# EAGLE schematic DL110 (EAGLE 9.6.2)
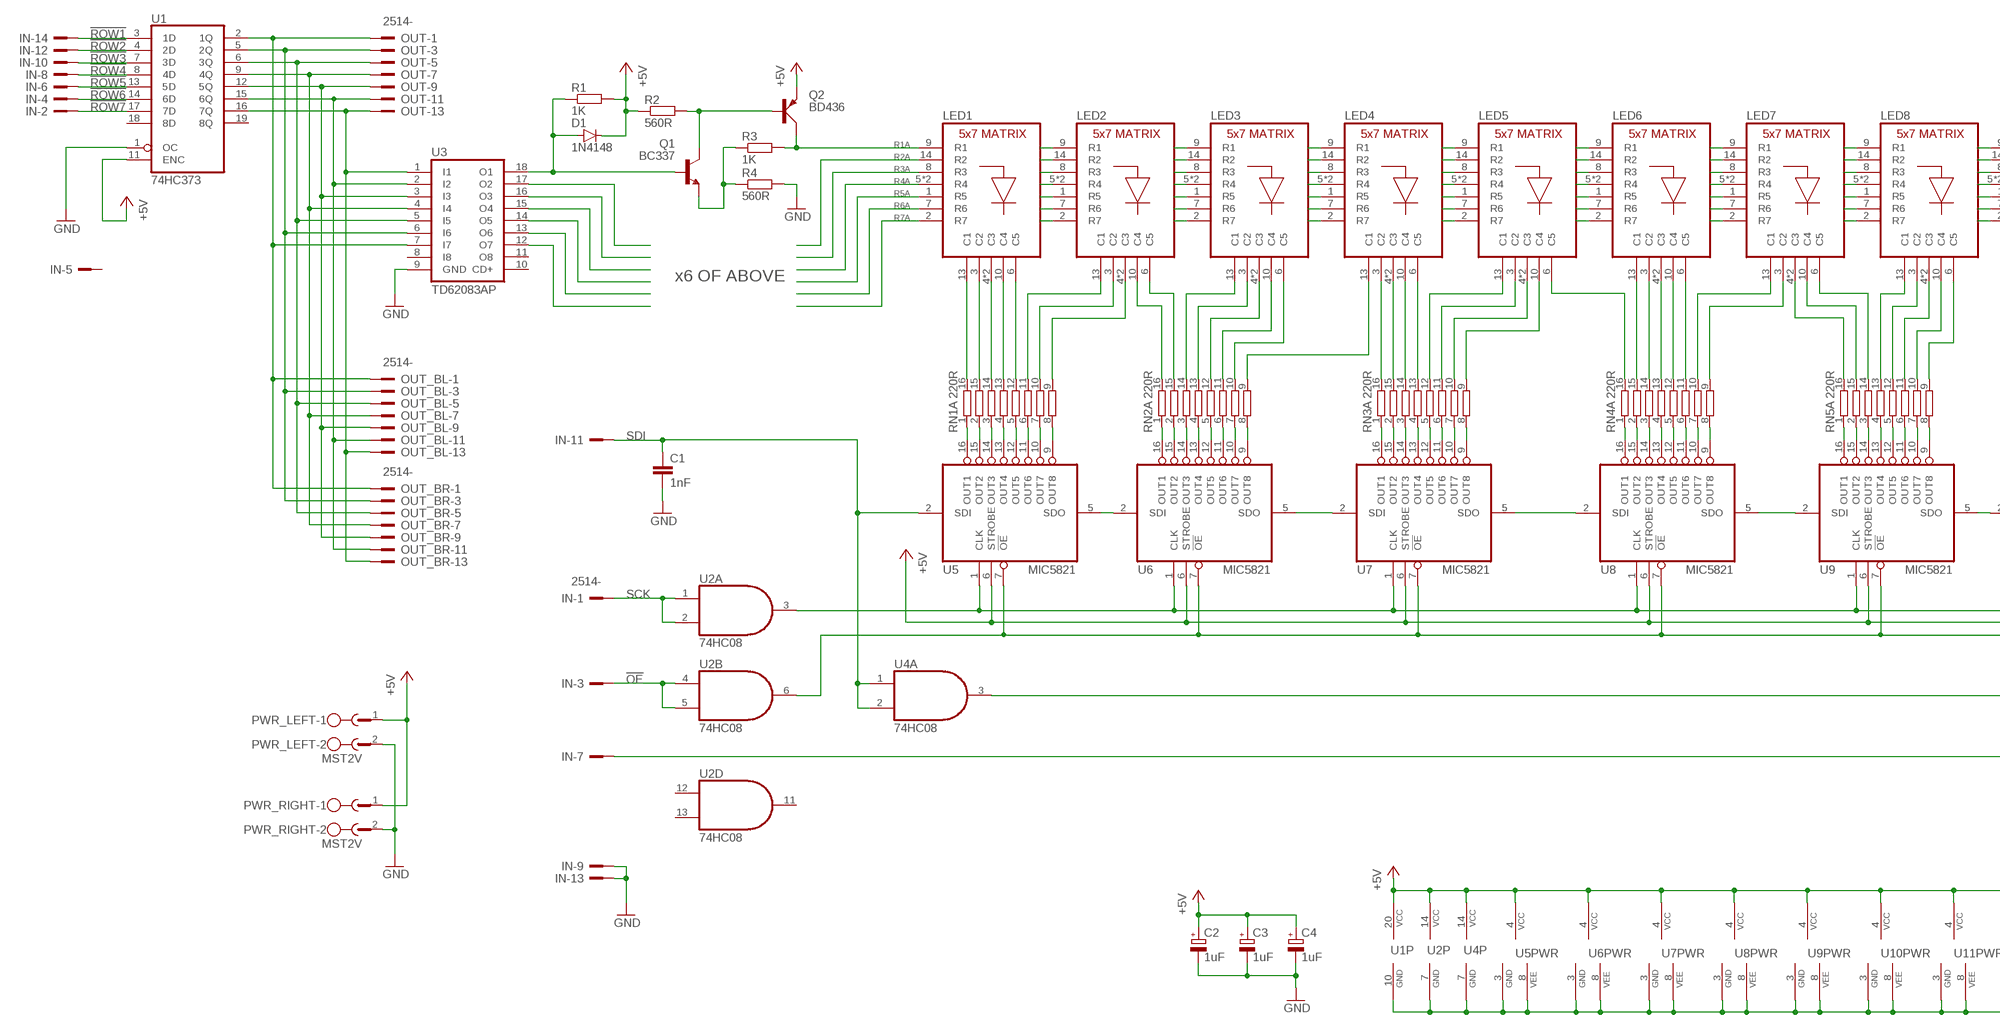
[diagram p0: schematic, sheet 1, part 1 of 2]
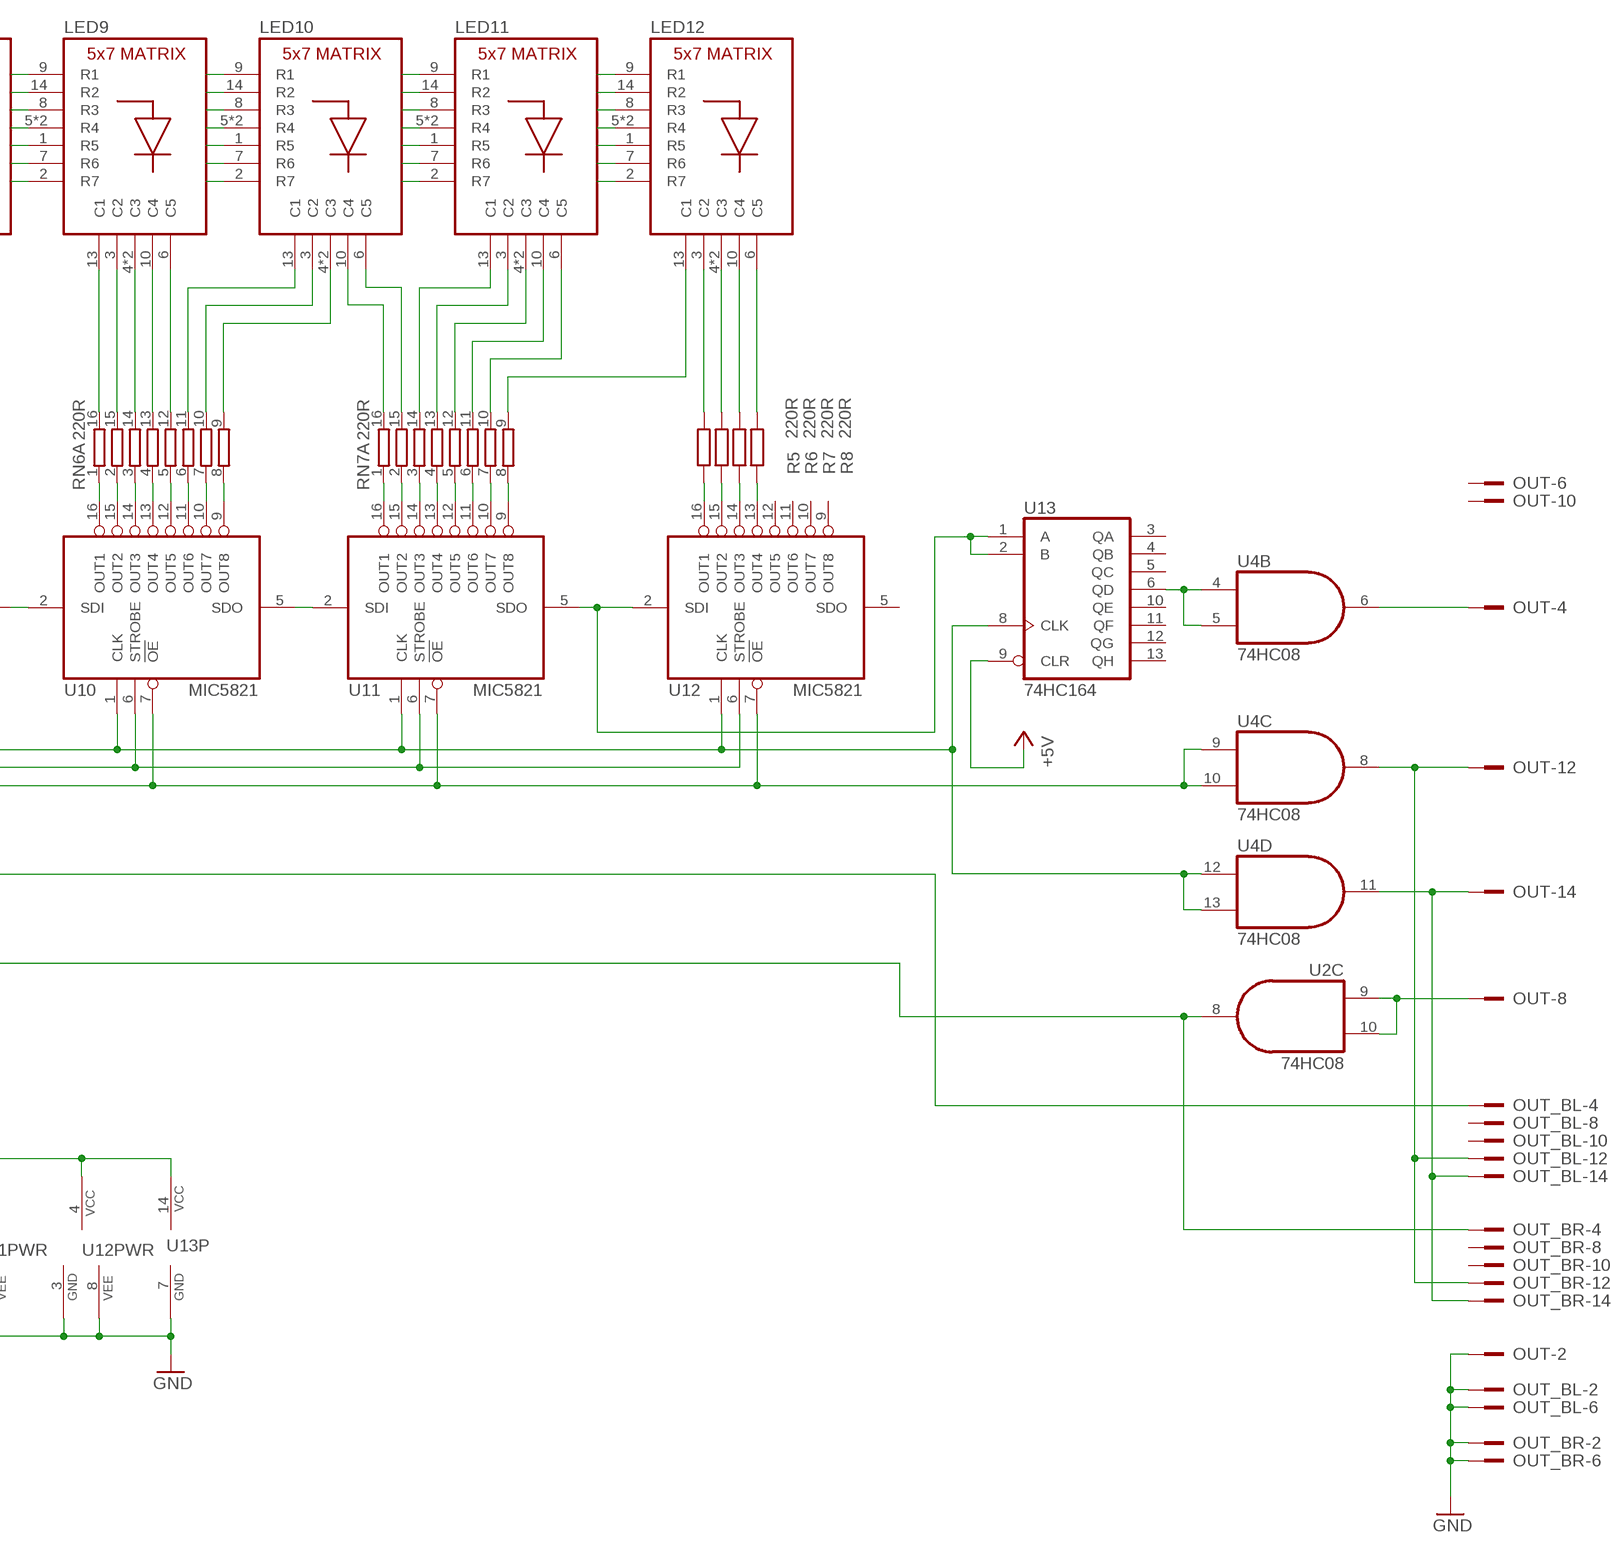
[diagram p1: schematic, sheet 1, part 2 of 2]

## Parts
C1  1nF  C-EU050-025X075  [C050-025X075]
C2  1uF  CPOL-EUE2.5-5  [E2,5-5]
C3  1uF  CPOL-EUE2.5-5  [E2,5-5]
C4  1uF  CPOL-EUE2.5-5  [E2,5-5]
D1  1N4148  1N4148DO35-10  [DO35-10]
IN  2514-  [PAK100/2500-14]
LED1  CSM-57141  [CSM-57141]
LED2  CSM-57141  [CSM-57141]
LED3  CSM-57141  [CSM-57141]
LED4  CSM-57141  [CSM-57141]
LED5  CSM-57141  [CSM-57141]
LED6  CSM-57141  [CSM-57141]
LED7  CSM-57141  [CSM-57141]
LED8  CSM-57141  [CSM-57141]
LED9  CSM-57141  [CSM-57141]
LED10  CSM-57141  [CSM-57141]
LED11  CSM-57141  [CSM-57141]
LED12  CSM-57141  [CSM-57141]
OUT  2514-  [PAK100/2500-14]
OUT_BL  2514-  [PAK100/2500-14]
OUT_BR  2514-  [PAK100/2500-14]
PWR_LEFT  MST2V  [MSTBV2]
PWR_RIGHT  MST2V  [MSTBV2]
Q1  BC337  [TO92]
Q2  BD436  BD438  [TO126AV]
R1  1K  R-EU_0207/10  [0207/10]
R2  560R  R-EU_0207/10  [0207/10]
R3  1K  R-EU_0207/10  [0207/10]
R4  560R  R-EU_0207/10  [0207/10]
R5  220R  R-EU_0207/10  [0207/10]
R6  220R  R-EU_0207/10  [0207/10]
R7  220R  R-EU_0207/10  [0207/10]
R8  220R  R-EU_0207/10  [0207/10]
RN1  220R  8R-N  [DIL16]
RN2  220R  8R-N  [DIL16]
RN3  220R  8R-N  [DIL16]
RN4  220R  8R-N  [DIL16]
RN5  220R  8R-N  [DIL16]
RN6  220R  8R-N  [DIL16]
RN7  220R  8R-N  [DIL16]
U1  74HC373  74LS373N  [DIL20]
U2  74HC08  74LS08N  [DIL14]
U3  TD62083AP  ULN2803A  [DIL18]
U4  74HC08  74LS08N  [DIL14]
U5  MIC5821  MIC5821BN  [DIL16]
U6  MIC5821  MIC5821BN  [DIL16]
U7  MIC5821  MIC5821BN  [DIL16]
U8  MIC5821  MIC5821BN  [DIL16]
U9  MIC5821  MIC5821BN  [DIL16]
U10  MIC5821  MIC5821BN  [DIL16]
U11  MIC5821  MIC5821BN  [DIL16]
U12  MIC5821  MIC5821BN  [DIL16]
U13  74HC164  74LS164N  [DIL14]

## Nets
!OE!: IN.3 U2.4(B:I0) U2.5(B:I1)
!ROW1!: IN.14 U1.3(1D)
!ROW2!: IN.12 U1.4(2D)
!ROW3!: IN.10 U1.7(3D)
!ROW4!: IN.8 U1.8(4D)
!ROW5!: IN.6 U1.13(5D)
!ROW6!: IN.4 U1.14(6D)
!ROW7!: IN.2 U1.17(7D)
+5V: C2.+ C3.+ C4.+ D1.C PWR_LEFT.1 PWR_RIGHT.1 Q2.E R1.2 R2.1 U1.11(ENC) U1.20(VCC) U2.14(P:VCC) U4.14(P:VCC) U5.4(VCC) U5.6(STROBE) U6.4(VCC) U6.6(STROBE) U7.4(VCC) U7.6(STROBE) U8.4(VCC) U8.6(STROBE) U9.4(VCC) U9.6(STROBE) U10.4(VCC) U10.6(STROBE) U11.4(VCC) U11.6(STROBE) U12.4(VCC) U12.6(STROBE) U13.9(CLR) U13.14(VCC)
GND: C1.2 C2.- C3.- C4.- IN.9 IN.13 OUT.2 OUT_BL.2 OUT_BL.6 OUT_BR.2 OUT_BR.6 PWR_LEFT.2 PWR_RIGHT.2 R4.2 U1.1(OC) U1.10(GND) U2.7(P:GND) U3.9(GND) U4.7(P:GND) U5.3(GND) U5.8(VEE) U6.3(GND) U6.8(VEE) U7.3(GND) U7.8(VEE) U8.3(GND) U8.8(VEE) U9.3(GND) U9.8(VEE) U10.3(GND) U10.8(VEE) U11.3(GND) U11.8(VEE) U12.3(GND) U12.8(VEE) U13.7(GND)
N$1: U2.3(A:O) U4.12(D:I0) U4.13(D:I1) U5.1(CLK) U6.1(CLK) U7.1(CLK) U8.1(CLK) U9.1(CLK) U10.1(CLK) U11.1(CLK) U12.1(CLK) U13.8(CLK)
N$2: U2.6(B:O) U4.9(C:I0) U4.10(C:I1) U5.7(!OE!) U6.7(!OE!) U7.7(!OE!) U8.7(!OE!) U9.7(!OE!) U10.7(!OE!) U11.7(!OE!) U12.7(!OE!)
N$3: OUT_BL.4 U4.3(A:O)
N$8: IN.7 OUT_BR.4 U2.8(C:O)
N$11: OUT.1 OUT_BL.1 OUT_BR.1 U1.2(1Q) U3.7(I7)
N$12: OUT.3 OUT_BL.3 OUT_BR.3 U1.5(2Q) U3.6(I6)
N$13: OUT.5 OUT_BL.5 OUT_BR.5 U1.6(3Q) U3.5(I5)
N$14: OUT.7 OUT_BL.7 OUT_BR.7 U1.9(4Q) U3.4(I4)
N$15: OUT.9 OUT_BL.9 OUT_BR.9 U1.12(5Q) U3.3(I3)
N$16: OUT.11 OUT_BL.11 OUT_BR.11 U1.15(6Q) U3.2(I2)
N$17: OUT.13 OUT_BL.13 OUT_BR.13 U1.16(7Q) U3.1(I1)
N$18: OUT.8 U2.9(C:I0) U2.10(C:I1)
N$19: Q1.3(C) Q2.B R2.2
N$20: D1.A Q1.2(B) R1.1 U3.18(O1)
N$21: Q1.1(E) R3.1 R4.1
N$22: OUT.4 U4.6(B:O)
N$23: U3.17(O2)
N$24: U3.16(O3)
N$25: U3.15(O4)
N$26: U3.14(O5)
N$27: U3.13(O6)
N$28: U3.12(O7)
N$29: U4.4(B:I0) U4.5(B:I1) U13.6(QD)
N$30: U5.5(SDO) U6.2(SDI)
N$31: U6.5(SDO) U7.2(SDI)
N$32: U7.5(SDO) U8.2(SDI)
N$33: U8.5(SDO) U9.2(SDI)
N$34: U9.5(SDO) U10.2(SDI)
N$35: U10.5(SDO) U11.2(SDI)
N$36: U11.5(SDO) U12.2(SDI) U13.1(A) U13.2(B)
N$37: RN1.1 U5.16(OUT1)
N$38: RN1.2 U5.15(OUT2)
N$39: RN1.3 U5.14(OUT3)
N$40: RN1.4 U5.13(OUT4)
N$41: RN1.5 U5.12(OUT5)
N$42: RN1.6 U5.11(OUT6)
N$43: RN1.7 U5.10(OUT7)
N$44: RN1.8 U5.9(OUT8)
N$45: RN2.1 U6.16(OUT1)
N$46: RN2.2 U6.15(OUT2)
N$47: RN2.3 U6.14(OUT3)
N$48: RN2.4 U6.13(OUT4)
N$49: RN2.5 U6.12(OUT5)
N$50: RN2.6 U6.11(OUT6)
N$51: RN2.7 U6.10(OUT7)
N$52: RN2.8 U6.9(OUT8)
N$53: RN3.1 U7.16(OUT1)
N$54: RN3.2 U7.15(OUT2)
N$55: RN3.3 U7.14(OUT3)
N$56: RN3.4 U7.13(OUT4)
N$57: RN3.5 U7.12(OUT5)
N$58: RN3.6 U7.11(OUT6)
N$59: RN3.7 U7.10(OUT7)
N$60: RN3.8 U7.9(OUT8)
N$61: RN4.1 U8.16(OUT1)
N$62: RN4.2 U8.15(OUT2)
N$63: RN4.3 U8.14(OUT3)
N$64: RN4.4 U8.13(OUT4)
N$65: RN4.5 U8.12(OUT5)
N$66: RN4.6 U8.11(OUT6)
N$67: RN4.7 U8.10(OUT7)
N$68: RN4.8 U8.9(OUT8)
N$69: RN5.1 U9.16(OUT1)
N$70: RN5.2 U9.15(OUT2)
N$71: RN5.3 U9.14(OUT3)
N$72: RN5.4 U9.13(OUT4)
N$73: RN5.5 U9.12(OUT5)
N$74: RN5.6 U9.11(OUT6)
N$75: RN5.7 U9.10(OUT7)
N$76: RN5.8 U9.9(OUT8)
N$77: RN6.1 U10.16(OUT1)
N$78: RN6.2 U10.15(OUT2)
N$79: RN6.3 U10.14(OUT3)
N$80: RN6.4 U10.13(OUT4)
N$81: RN6.5 U10.12(OUT5)
N$82: RN6.6 U10.11(OUT6)
N$83: RN6.7 U10.10(OUT7)
N$84: RN6.8 U10.9(OUT8)
N$85: RN7.1 U11.16(OUT1)
N$86: RN7.2 U11.15(OUT2)
N$87: RN7.3 U11.14(OUT3)
N$88: RN7.4 U11.13(OUT4)
N$89: RN7.5 U11.12(OUT5)
N$90: RN7.6 U11.11(OUT6)
N$91: RN7.7 U11.10(OUT7)
N$92: RN7.8 U11.9(OUT8)
N$93: R5.1 U12.16(OUT1)
N$94: R6.1 U12.15(OUT2)
N$95: R7.1 U12.14(OUT3)
N$96: R8.1 U12.13(OUT4)
N$97: OUT.12 OUT_BL.12 OUT_BR.12 U4.8(C:O)
N$98: LED9.13(C1) RN6.16
N$99: LED1.13(C1) RN1.16
N$100: LED1.3(C2) RN1.15
N$101: LED1.4(C3) LED1.11(C3) RN1.14
N$102: LED1.10(C4) RN1.13
N$103: LED1.6(C5) RN1.12
N$104: LED2.13(C1) RN1.11
N$105: LED2.3(C2) RN1.10
N$106: LED2.4(C3) LED2.11(C3) RN1.9
N$107: LED2.10(C4) RN2.16
N$108: LED2.6(C5) RN2.15
N$109: LED3.13(C1) RN2.14
N$110: LED3.3(C2) RN2.13
N$111: LED3.4(C3) LED3.11(C3) RN2.12
N$112: LED3.10(C4) RN2.11
N$113: LED3.6(C5) RN2.10
N$114: LED4.13(C1) RN2.9
N$115: LED4.3(C2) RN3.16
N$116: LED4.4(C3) LED4.11(C3) RN3.15
N$117: LED4.10(C4) RN3.14
N$118: LED4.6(C5) RN3.13
N$119: LED5.13(C1) RN3.12
N$120: LED5.3(C2) RN3.11
N$121: LED5.4(C3) LED5.11(C3) RN3.10
N$122: LED5.10(C4) RN3.9
N$123: LED5.6(C5) RN4.16
N$124: LED6.13(C1) RN4.15
N$125: LED6.3(C2) RN4.14
N$126: LED6.4(C3) LED6.11(C3) RN4.13
N$127: LED6.10(C4) RN4.12
N$128: LED6.6(C5) RN4.11
N$129: LED7.13(C1) RN4.10
N$130: LED7.3(C2) RN4.9
N$131: LED7.4(C3) LED7.11(C3) RN5.16
N$132: LED7.10(C4) RN5.15
N$133: LED7.6(C5) RN5.14
N$134: LED8.13(C1) RN5.13
N$135: LED8.3(C2) RN5.12
N$136: LED8.4(C3) LED8.11(C3) RN5.11
N$137: LED8.10(C4) RN5.10
N$138: LED8.6(C5) RN5.9
N$139: LED9.3(C2) RN6.15
N$140: LED9.4(C3) LED9.11(C3) RN6.14
N$141: LED9.10(C4) RN6.13
N$142: LED9.6(C5) RN6.12
N$143: LED10.13(C1) RN6.11
N$144: LED10.3(C2) RN6.10
N$145: LED10.4(C3) LED10.11(C3) RN6.9
N$146: LED10.10(C4) RN7.16
N$147: LED10.6(C5) RN7.15
N$148: LED11.13(C1) RN7.14
N$149: LED11.3(C2) RN7.13
N$150: LED11.4(C3) LED11.11(C3) RN7.12
N$151: LED11.10(C4) RN7.11
N$152: LED11.6(C5) RN7.10
N$153: LED12.13(C1) RN7.9
N$154: LED12.3(C2) R5.2
N$155: LED12.4(C3) LED12.11(C3) R6.2
N$156: LED12.10(C4) R7.2
N$157: LED12.6(C5) R8.2
N$158: OUT.14 OUT_BL.14 OUT_BR.14 U4.11(D:O)
R1A: LED1.9(R1) LED2.9(R1) LED3.9(R1) LED4.9(R1) LED5.9(R1) LED6.9(R1) LED7.9(R1) LED8.9(R1) LED9.9(R1) LED10.9(R1) LED11.9(R1) LED12.9(R1) Q2.C R3.2
R2A: LED1.14(R2) LED2.14(R2) LED3.14(R2) LED4.14(R2) LED5.14(R2) LED6.14(R2) LED7.14(R2) LED8.14(R2) LED9.14(R2) LED10.14(R2) LED11.14(R2) LED12.14(R2)
R3A: LED1.8(R3) LED2.8(R3) LED3.8(R3) LED4.8(R3) LED5.8(R3) LED6.8(R3) LED7.8(R3) LED8.8(R3) LED9.8(R3) LED10.8(R3) LED11.8(R3) LED12.8(R3)
R4A: LED1.5(R4) LED1.12(R4) LED2.5(R4) LED2.12(R4) LED3.5(R4) LED3.12(R4) LED4.5(R4) LED4.12(R4) LED5.5(R4) LED5.12(R4) LED6.5(R4) LED6.12(R4) LED7.5(R4) LED7.12(R4) LED8.5(R4) LED8.12(R4) LED9.5(R4) LED9.12(R4) LED10.5(R4) LED10.12(R4) LED11.5(R4) LED11.12(R4) LED12.5(R4) LED12.12(R4)
R5A: LED1.1(R5) LED2.1(R5) LED3.1(R5) LED4.1(R5) LED5.1(R5) LED6.1(R5) LED7.1(R5) LED8.1(R5) LED9.1(R5) LED10.1(R5) LED11.1(R5) LED12.1(R5)
R6A: LED1.7(R6) LED2.7(R6) LED3.7(R6) LED4.7(R6) LED5.7(R6) LED6.7(R6) LED7.7(R6) LED8.7(R6) LED9.7(R6) LED10.7(R6) LED11.7(R6) LED12.7(R6)
R7A: LED1.2(R7) LED2.2(R7) LED3.2(R7) LED4.2(R7) LED5.2(R7) LED6.2(R7) LED7.2(R7) LED8.2(R7) LED9.2(R7) LED10.2(R7) LED11.2(R7) LED12.2(R7)
SCK: IN.1 U2.1(A:I0) U2.2(A:I1)
SDI: C1.1 IN.11 U4.1(A:I0) U4.2(A:I1) U5.2(SDI)
Unconnected: IN.5 OUT.6 OUT.10 OUT_BL.8 OUT_BL.10 OUT_BR.8 OUT_BR.10 U1.18(8D) U1.19(8Q) U2.11(D:O) U2.12(D:I0) U2.13(D:I1) U3.8(I8) U3.10(CD+) U3.11(O8) U12.5(SDO) U12.9(OUT8) U12.10(OUT7) U12.11(OUT6) U12.12(OUT5) U13.3(QA) U13.4(QB) U13.5(QC) U13.10(QE) U13.11(QF) U13.12(QG) U13.13(QH)

## Notes on the sheet
- x6 OF ABOVE

## Library data of the parts
C1 = rcl:C-EU: CAPACITOR, European symbol; SPICEPREFIX: C
C2-C4 = rcl:CPOL-EU: POLARIZED CAPACITOR, European symbol; SPICEPREFIX: C
D1 = diode:1N4148: DIODE high speed (Philips)
IN OUT_BL OUT_BR = con-3m:2514-: 3M (TM) Pak 100 4-Wall Header Source: 3M; OC_FARNELL: unknown; OC_NEWARK: unknown
LED1-LED12 = DL110:CSM-57141
OUT = con-3m:2514-: 3M (TM) Pak 100 4-Wall Header Source: 3M; OC_FARNELL: unknown; OC_NEWARK: unknown; SPICEPREFIX: X
PWR_LEFT PWR_RIGHT = con-phoenix-508:MST2V: PHOENIX; OC_FARNELL: unknown; OC_NEWARK: unknown
Q1 = transistor-npn:BC337*: NPN Transistor
Q2 = transistor-power:BD438: PNP TRANSISTOR
R1-R8 = rcl:R-EU_: RESISTOR, European symbol; SPICEPREFIX: R
RN1-RN7 = resistor-dil:8R-N: DIL RESISTOR; OC_FARNELL: unknown; OC_NEWARK: unknown
U1 = 74xx-us:74*373: Octal D type transparent LATCH, edge triggered
U2 U4 = 74xx-us:74*08: Quad 2-input AND gate
U3 = uln-udn:ULN2803A: DRIVER ARRAY
U5-U12 = DL110:MIC5821B
U13 = 74xx-us:74*164: 8-bit parallel out SHIFT REGISTER